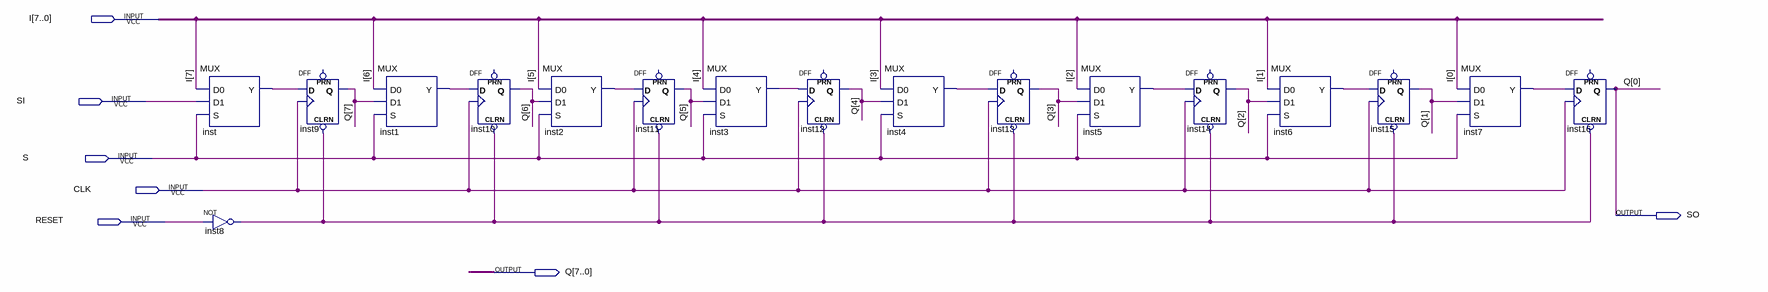
[diagram p0: schematic sheet]
// Quartus schematic REGISTER.bdf as structural Verilog: 17 symbols, 7 pins
module REGISTER (
  input  [7:0] I,
  input  SI,
  input  S,
  input  CLK,
  input  RESET,
  output SO,
  output [7:0] Q
);

  wire inst1_y, inst2_y, inst3_y, inst4_y, inst5_y, inst6_y, inst7_y, inst8_out, inst_y;

  MUX inst (.D0(I[7]), .D1(SI), .S(S), .Y(inst_y));
  not inst8 (inst8_out, RESET);
  DFF inst9 (.CLRN(inst8_out), .CLK(CLK), .D(inst_y), .Q(Q[7]));  // open: PRN
  MUX inst1 (.D0(I[6]), .D1(Q[7]), .S(S), .Y(inst1_y));
  DFF inst10 (.CLRN(inst8_out), .CLK(CLK), .D(inst1_y), .Q(Q[6]));  // open: PRN
  MUX inst2 (.D0(I[5]), .D1(Q[6]), .S(S), .Y(inst2_y));
  DFF inst11 (.CLRN(inst8_out), .CLK(CLK), .D(inst2_y), .Q(Q[5]));  // open: PRN
  MUX inst3 (.D0(I[4]), .D1(Q[5]), .S(S), .Y(inst3_y));
  DFF inst12 (.CLRN(inst8_out), .CLK(CLK), .D(inst3_y), .Q(Q[4]));  // open: PRN
  MUX inst4 (.D0(I[3]), .D1(Q[4]), .S(S), .Y(inst4_y));
  DFF inst13 (.CLRN(inst8_out), .CLK(CLK), .D(inst4_y), .Q(Q[3]));  // open: PRN
  MUX inst5 (.D0(I[2]), .D1(Q[3]), .S(S), .Y(inst5_y));
  DFF inst14 (.CLRN(inst8_out), .CLK(CLK), .D(inst5_y), .Q(Q[2]));  // open: PRN
  MUX inst6 (.D0(I[1]), .D1(Q[2]), .S(S), .Y(inst6_y));
  DFF inst15 (.CLRN(inst8_out), .CLK(CLK), .D(inst6_y), .Q(Q[1]));  // open: PRN
  MUX inst7 (.D0(I[0]), .D1(Q[1]), .S(S), .Y(inst7_y));
  DFF inst16 (.CLRN(inst8_out), .CLK(CLK), .D(inst7_y), .Q(Q[0]));  // open: PRN

  assign SO = Q[0];
endmodule
